# EAGLE design 009 (EAGLE 9.6.2)
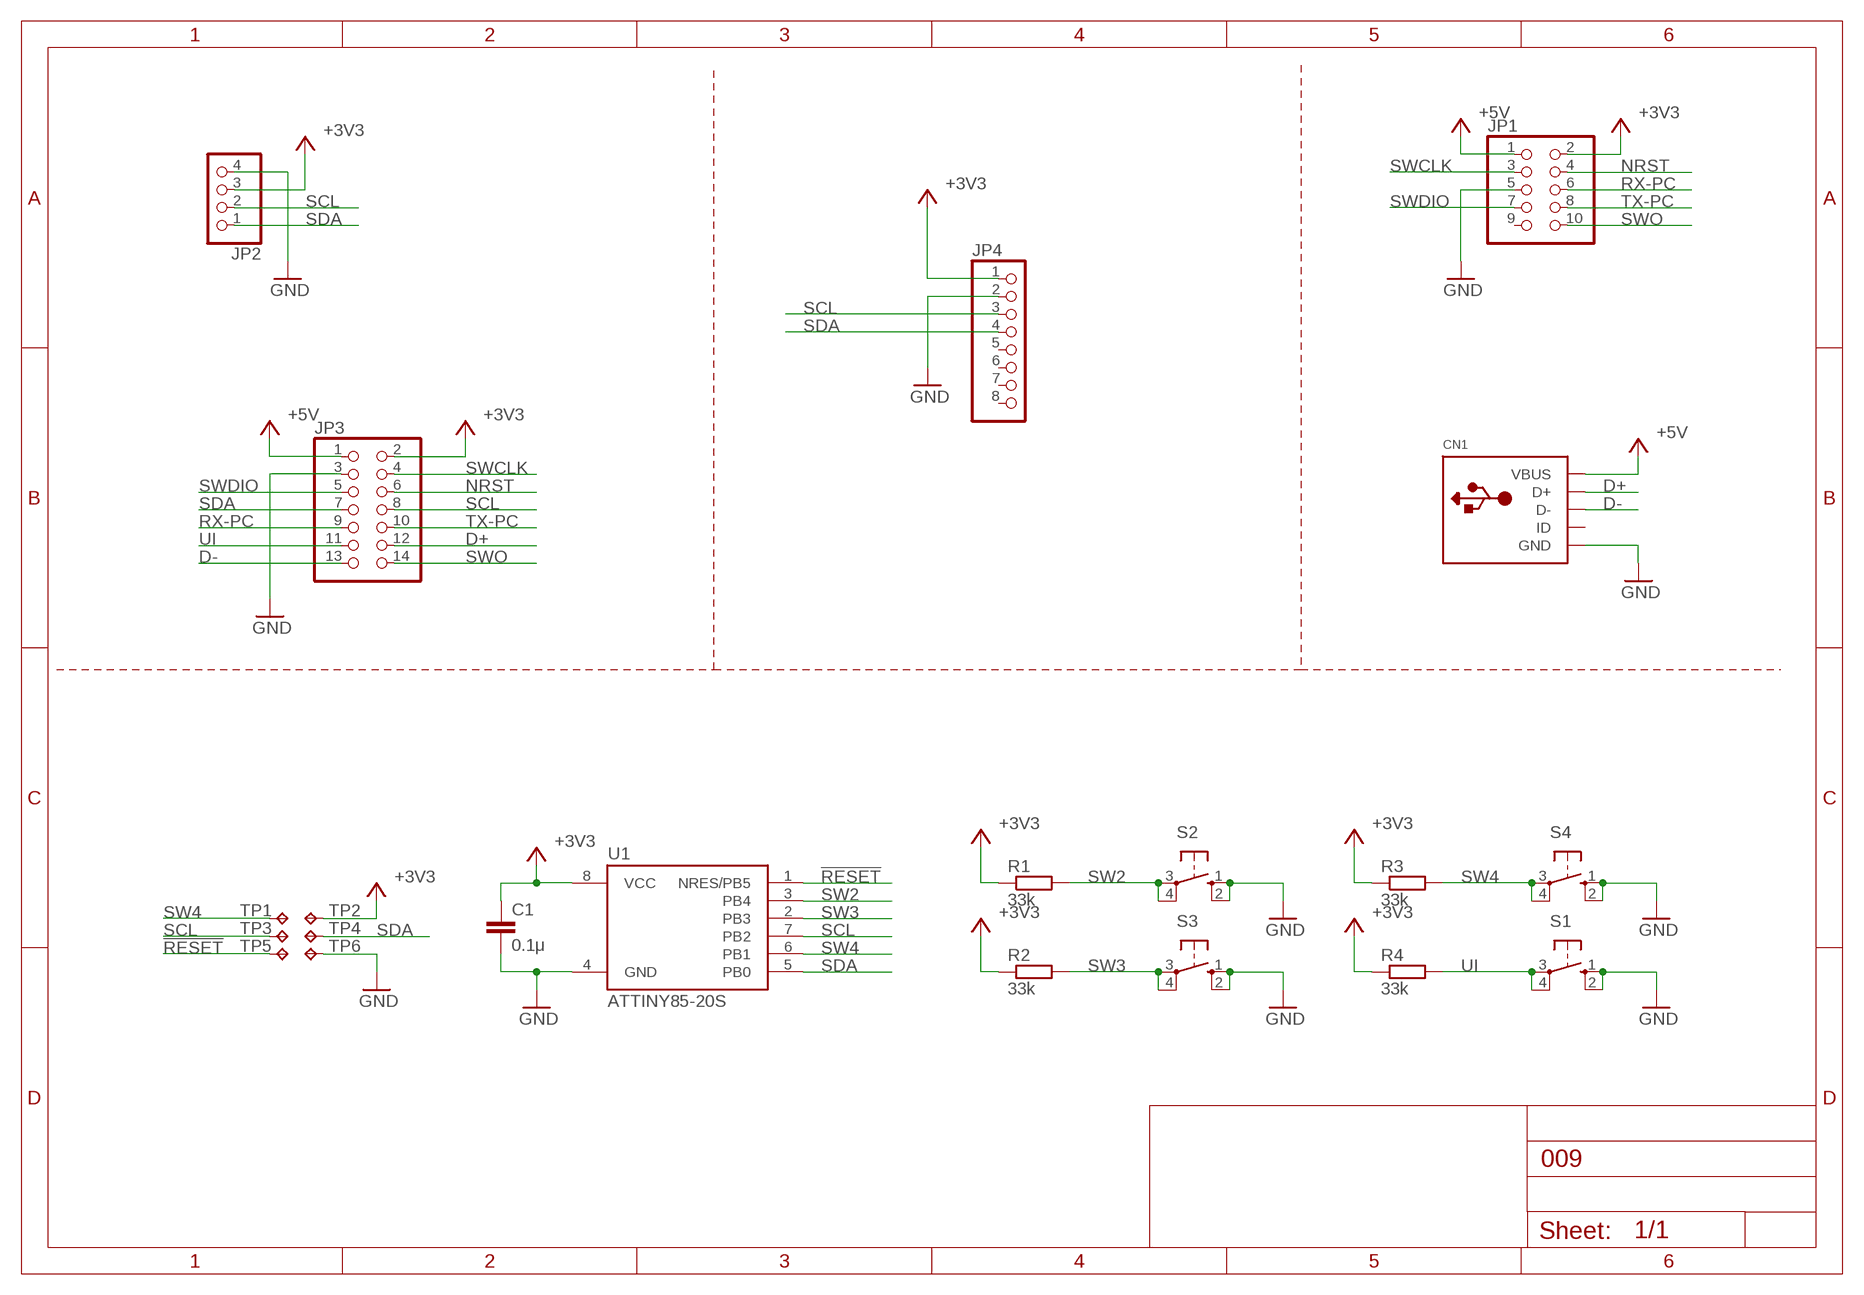
[diagram p0: schematic, sheet 1]

## Parts
C1  0.1μ  C-EUC0603  [C0603]
CN1  USBTHM  [USB-MINIB-THM]
JP1  PINHD-2X5  [2X05]
JP2  PINHD-1X4  [1X04]
JP3  PINHD-2X7/90  [2X07/90]
JP4  PINHD-1X8  [1X08]
R1  33k  R-EU_R0603  [R0603]
R2  33k  R-EU_R0603  [R0603]
R3  33k  R-EU_R0603  [R0603]
R4  33k  R-EU_R0603  [R0603]
S1  40-XX  [B3F-40XX]
S2  40-XX  [B3F-40XX]
S3  10-XX  [B3F-10XX]
S4  10-XX  [B3F-10XX]
TP1  TPTP15SQ  [TP15SQ]
TP2  TPTP15R  [TP15R]
TP3  TPTP15R  [TP15R]
TP4  TPTP15R  [TP15R]
TP5  TPTP15R  [TP15R]
TP6  TPTP15R  [TP15R]
U1  ATTINY85-20S  [SOIC8_EIAJ_208MIL]

## Nets
!RESET: TP5.TP U1.1(NRES/PB5)
+3V3 [PWR]: C1.1 JP1.2 JP2.3 JP3.2 JP4.1 R1.1 R2.1 R3.1 R4.1 TP2.TP U1.8(VCC)
+5V [PWR]: CN1.VBUS JP1.1 JP3.1
D+: CN1.D+ JP3.12
D-: CN1.D- JP3.13
GND [PWR]: C1.2 CN1.GND JP1.5 JP2.4 JP3.3 JP4.2 S1.1(S) S1.2(S1) S2.1(S) S2.2(S1) S3.1(S) S3.2(S1) S4.1(S) S4.2(S1) TP6.TP U1.4(GND)
NRST: JP1.4 JP3.6
RX-PC: JP1.6 JP3.9
SCL: JP2.2 JP3.8 JP4.3 TP3.TP U1.7(PB2)
SDA: JP2.1 JP3.7 JP4.4 TP4.TP U1.5(PB0)
SW2: R1.2 S2.3(P) S2.4(P1) U1.3(PB4)
SW3: R2.2 S3.3(P) S3.4(P1) U1.2(PB3)
SW4: R3.2 S4.3(P) S4.4(P1) TP1.TP U1.6(PB1)
SWCLK: JP1.3 JP3.4
SWDIO: JP1.7 JP3.5
SWO: JP1.10 JP3.14
TX-PC: JP1.8 JP3.10
UI: JP3.11 R4.2 S1.3(P) S1.4(P1)
Unconnected: CN1.ID JP1.9 JP4.5 JP4.6 JP4.7 JP4.8

## Library data of the parts
C1 = rcl:C-EU: CAPACITOR, European symbol; SPICEPREFIX: C
CN1 = adafruit:USB: USB Connectors USBMINIB - Surface Mount Female Mini-B USB Connector 4UConnector: 06564 By microbuilder.eu Thru-hole RA Female Mini-B USB Connector 4UConnector: 18732 By ladyada.net
JP1 = pinhead:PINHD-2X5: PIN HEADER
JP2 = pinhead:PINHD-1X4: PIN HEADER
JP3 = pinhead:PINHD-2X7: PIN HEADER
JP4 = pinhead:PINHD-1X8: PIN HEADER
R1-R4 = rcl:R-EU_: RESISTOR, European symbol; SPICEPREFIX: R
S1 S2 = switch-omron:40-XX: OMRON SWITCH; MF: OMRON COMPONENTS USA; MPN: B3F-4000; OC_FARNELL: 176434; OC_NEWARK: 36K3105
S3 S4 = switch-omron:10-XX: OMRON SWITCH; MPN: B3F-1000; OC_FARNELL: 176432; OC_NEWARK: 36M3542
TP1-TP6 = testpad:TP: Test pad
U1 = _hhn_attiny25_45_85:ATTINY85*: ATMEL ATtiny 85 Packages: P = PDIP 08 30mil S = SOIC 08 EIAJ 208mil Technologies Note: for complete ordering code (temp. range, finish, tape&reel etc.) see www.atmel.com • Supply Voltage: V = (1.8…5.5)V | [blank] = (2.7…5.5)V • Speed: 10 = 10 MHz | 20 = 20 MHz Author: Dipl.-Ing. FH Rainer Bayer HHN Hochschule Heilbronn (Heilbronn University), rainer.bayer@hs-heilbronn.de Ingenieurbüro ing-rb, mail@ing-rb.de

## Net classes
0 default: width 0.508 mm
1 PWR: width 0.762 mm

## Board
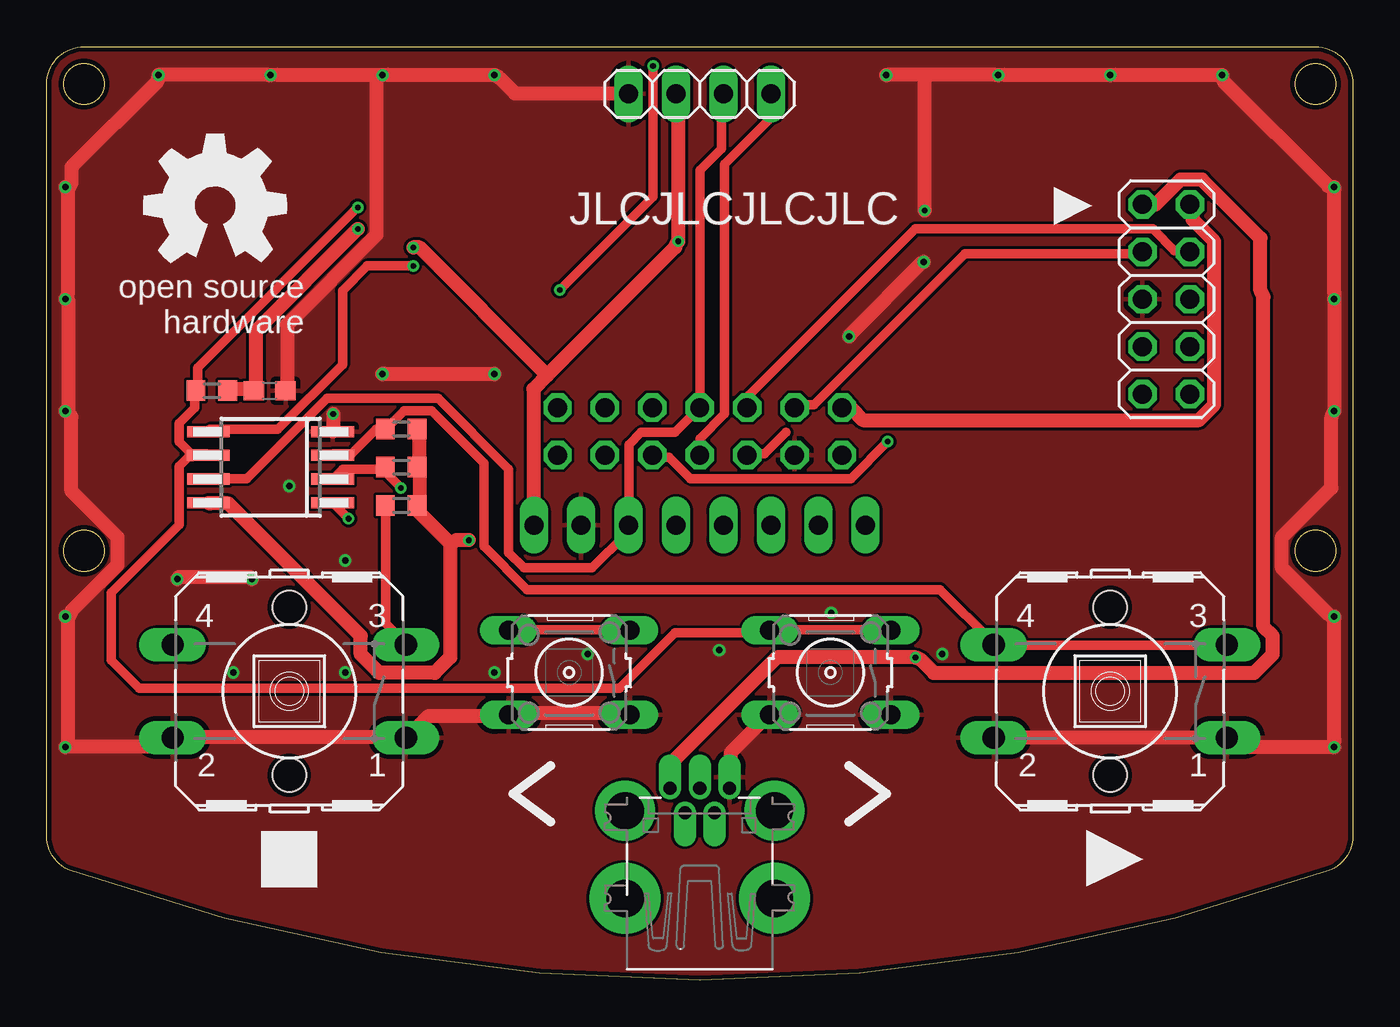
[diagram p1: board, top side]
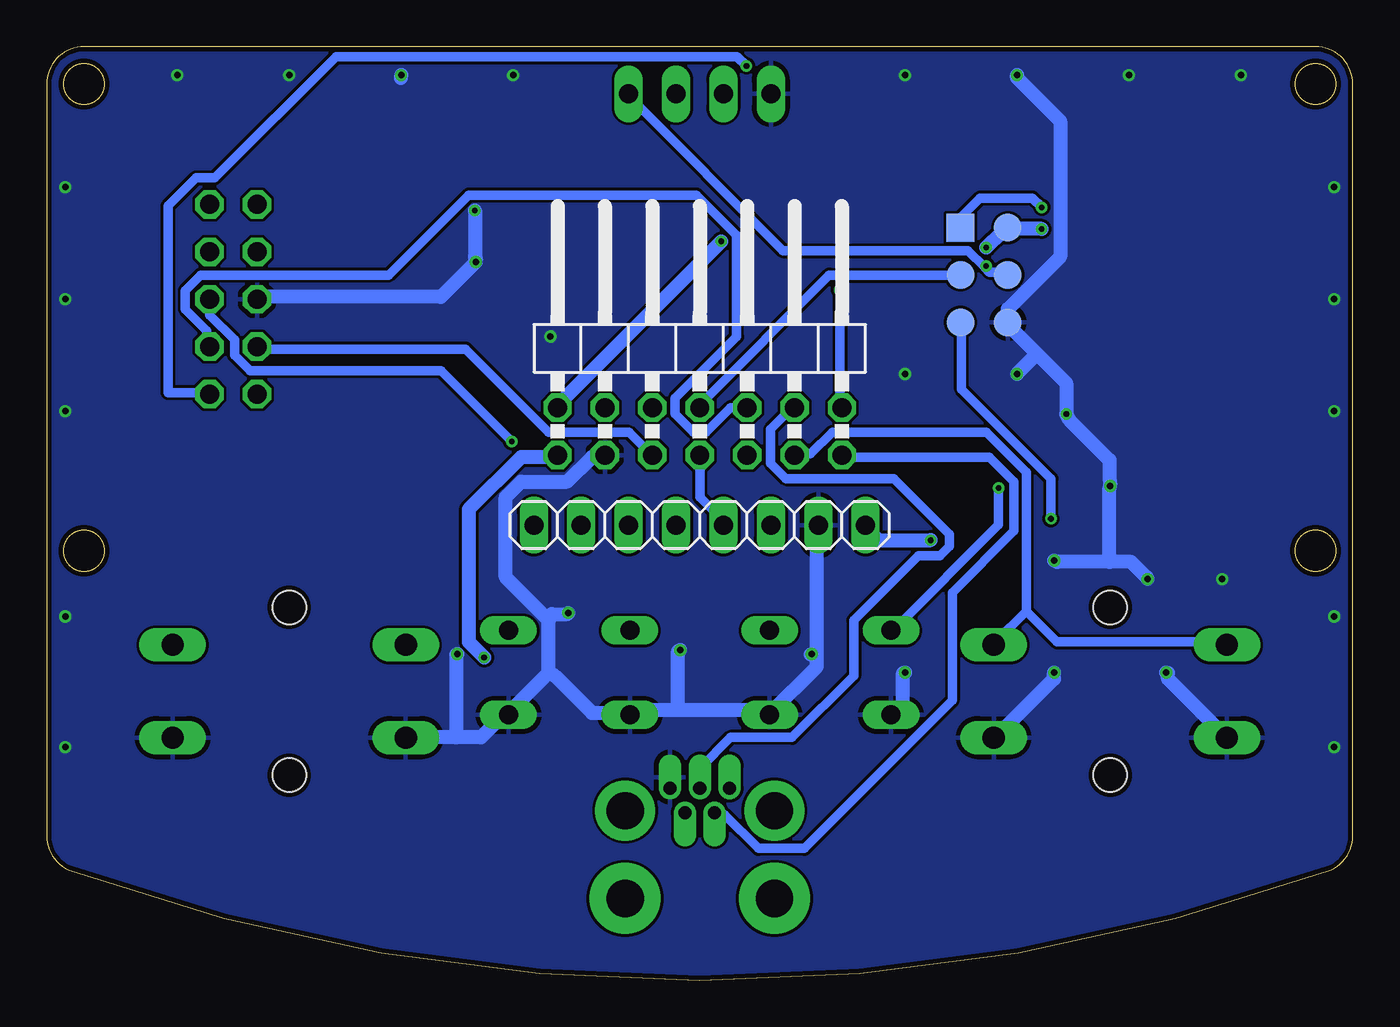
[diagram p2: board, bottom side, seen from below]

Size 70 x 50 mm. Coordinates in mm from the lower left corner, seen from the top.
Outline: 0,48 arc-90 2,50 68,50 arc-90 70,48 70,7.72 arc-70 68.67,5.84 arc-39 1.33,5.84 arc-70 0,7.72 0,48
Outline: circle at 68,23 radius 1.1
Outline: circle at 68,48 radius 1.1
Outline: circle at 2,23 radius 1.1
Outline: circle at 2,48 radius 1.1
Copper layers (1*16): Top 0.035mm / dielectric 1.5mm / Bottom 0.035mm
Design rules "SeeedStudio_2layer_DRU_no_angle_20140221": minimum track width 6mil, minimum drill 12mil, track to track 6mil, track to pad 6mil, pad to pad 6mil, via to via 6mil, smd to smd 0mil, copper to edge 10mil, drill to drill 10mil, minimum pad ring 10mil, minimum via ring 6mil, stop-mask expansion 2mil, vias tented up to drill 100mil, thermal gap 10mil

### Footprints (pad centres in the part's own frame; a part is rotated, then mirrored left to right if it is on the bottom)
C0603 = smd 1.1 x 1: 1 -0.85,0; 2 0.85,0
USB-MINIB-THM = drill 0.7 offset: D+ 0,9.8; D- -0.8,8.5; GND 1.6,9.8; ID 0.8,8.5; VBUS -1.6,9.8 | drill 2 pad 3.81: GND1 -4,3.9; GND4 4,3.9 | drill 2 pad 3.2: GND2 -4,8.6; GND3 4,8.6
2X05 = drill 1.016 octagon: 1 -5.08,-1.27; 2 -5.08,1.27; 3 -2.54,-1.27; 4 -2.54,1.27; 5 0,-1.27; 6 0,1.27; 7 2.54,-1.27; 8 2.54,1.27; 9 5.08,-1.27; 10 5.08,1.27
1X04 = drill 1.016 long: 1 -3.81,0; 2 -1.27,0; 3 1.27,0; 4 3.81,0
2X07/90 = drill 1.016 octagon: 1 -7.62,-6.35; 2 -7.62,-3.81; 3 -5.08,-6.35; 4 -5.08,-3.81; 5 -2.54,-6.35; 6 -2.54,-3.81; 7 0,-6.35; 8 0,-3.81; 9 2.54,-6.35; 10 2.54,-3.81; 11 5.08,-6.35; 12 5.08,-3.81; 13 7.62,-6.35; 14 7.62,-3.81
1X08 = drill 1.016 long: 1 -8.89,0; 2 -6.35,0; 3 -3.81,0; 4 -1.27,0; 5 1.27,0; 6 3.81,0; 7 6.35,0; 8 8.89,0
R0603 = smd 1 x 1.1: 1 -0.85,0; 2 0.85,0
B3F-40XX = drill 1.194 long: 1 -6.248,2.489; 2 6.248,2.489; 3 -6.248,-2.489; 4 6.248,-2.489 | hole 1.803: 0,-4.496; 0,4.496
B3F-10XX = drill 1.016 long: 1 -3.251,2.261; 2 3.251,2.261; 3 -3.251,-2.261; 4 3.251,-2.261
TP15SQ = smd 1.5 x 1.5: TP 0,0
TP15R = smd 1.5 x 1.5: TP 0,0
SOIC8_EIAJ_208MIL = smd 0.6 x 2.286: 1 -1.905,-3.33; 2 -0.635,-3.33; 3 0.635,-3.33; 4 1.905,-3.33; 5 1.905,3.33; 6 0.635,3.33; 7 -0.635,3.33; 8 -1.905,3.33

### Placement (x,y rotation side)
C1  11.95,31.57 0 top
CN1  35,0.47 0 top
JP1  60,36.47 270 top
JP2  35,47.47 180 top
JP3  35,34.47 0 bottom
JP4  35,24.37 180 bottom
R1  19,29.52 180 top
R2  19,27.47 180 top
R3  8.85,31.57 180 top
R4  19,25.42 180 top
S1  13,15.47 180 top
S2  57,15.47 180 top
S3  28,16.47 180 top
S4  42,16.47 180 top
TP1  21.03,40.31 0 bottom
TP2  18.49,40.31 0 bottom
TP3  21.03,37.77 0 bottom
TP4  18.49,37.77 0 bottom
TP5  21.03,35.23 0 bottom
TP6  18.49,35.23 0 bottom
U1  12,27.47 90 top
U$1  [OSHW_8MM]  9,41.47 0 top

### Tracks (layer width: path | path; a pad name or v marks a point on that pad's centre or on a via)
!RESET  (via drill 0.3)
  Top 0.508: v16.18,24.71 15.35,25.54 U1.1
  Bottom 0.508: v16.18,24.71 16.18,26.86 20.97,31.65 20.97,35.12 TP5.TP
+3V3  (via drill 0.3)
  Top 0.762: R1.1 19.98,29.5 19.98,27.85 R2.1 19.98,27.36 19.98,25.54 R4.1 19.98,25.05 21.63,23.39 | 21.63,23.39 21.63,17.29 20.8,16.46 17.83,16.46 16.84,17.45 16.84,18.44 9.74,25.54 8.75,25.54 U1.8 | R3.1 9.74,31.65 11.06,31.65 C1.1 11.23,31.98 11.23,34.79 v16.67,40.23 | JP2.3 33.84,47.33 v33.84,39.57 33.68,39.24 26.83,32.39 | 42.76,30.82 JP3.2 43.09,30.66 43.75,30 61.75,30 62.57,30.82 62.57,39.57 61.42,40.73 61.42,41.39 JP1.2 | 26.09,24.47 26.09,31.65 26.83,32.39 | 26.09,24.47 26.09,24.38 | v19.65,39.24 19.98,39.24 26.83,32.39 | v22.62,23.56 21.96,23.56 21.63,23.39 | JP4.1 26,24.47 26.09,24.47
  Bottom 0.762: v16.67,40.23 18.49,40.23 TP2.TP 18.82,40.07 v19.65,39.24 | v33.84,39.57 42.59,30.82 JP3.2 | v22.62,23.56 25.42,23.56 25.92,24.05 | 26.09,24.22 25.92,24.05 | JP4.1 26,23.97 25.92,24.05
+5V  (via drill 0.3)
  Top 0.762: CN1.VBUS 33.51,10.35 33.51,11.67 39.13,17.29 v46.56,17.29 46.89,17.12 47.55,16.46 64.72,16.46 65.71,17.45 65.71,18.44 65.21,18.94 65.21,36.6 65.05,36.93 65.05,39.74 61.91,42.88 60.76,42.88 59.44,41.56 58.77,41.56 JP1.1
  Bottom 0.762: v46.56,17.29 47.38,18.11 47.38,25.21 44.58,28.02 42.76,28.02 JP3.1
D+
  Bottom 0.508: CN1.D+ 35,11.34 33.35,12.99 30.05,12.99 26.74,16.29 26.74,19.27 23.28,22.73 22.12,22.73 21.63,23.23 21.63,23.89 24.6,26.86 30.38,26.86 31.2,27.69 31.2,29.5 30.05,30.66 JP3.12
D-
  Bottom 0.508: CN1.D- 34.17,8.87 33.68,8.87 31.86,7.05 29.39,7.05 21.46,14.97 21.46,20.75 18.16,24.05 18.16,26.7 19.48,28.02 27.24,28.02 JP3.13
GND  (via drill 0.3, 0.35)
  Top 0.762: 1.15,30.49 1.15,36.44 v1,36.47 1.15,36.77 1.15,42.38 | 1.15,30.49 v1,30.47 | 1.15,42.38 v1,42.47 | 17.66,48.49 12.38,48.49 v12,48.47 11.89,48.49 6.11,48.49 v6,48.47 5.94,48.16 1.32,43.54 1.32,42.71 1.15,42.38 | 17.66,48.49 18,48.49 v18,48.47 18.32,48.49 23.94,48.49 v24,48.47 24.27,48.32 25.09,47.5 31.04,47.5 JP2.4 | 17.66,48.49 17.66,39.9 12.88,35.12 12.88,31.65 C1.2 | v15.35,30.33 15.35,29.5 U1.4 | 1.15,12.5 6.27,12.5 6.6,12.83 S1.2 7.1,12.99 18.98,12.99 S1.1 19.32,12.99 20.47,14.15 24.6,14.15 S3.2 25.09,14.31 31.2,14.31 S3.1 | 1.15,12.5 v1,12.47 | 1.15,12.5 1.15,19.43 | 1.15,19.43 v1,19.47 | 47.05,48.49 50.85,48.49 v51,48.47 51.34,48.49 56.96,48.49 v57,48.47 57.29,48.49 62.9,48.49 v63,48.47 63.07,48.16 68.68,42.55 v69,42.47 69.01,42.38 69.01,36.77 v69,36.47 69.01,36.44 69.01,30.49 v69,30.47 68.85,30.16 68.85,26.37 66.2,23.72 66.2,22.07 68.68,19.6 v69,19.47 69.01,19.43 69.01,12.83 68.85,12.5 | 47.05,48.49 45.07,48.49 v45,48.47 | 68.85,12.5 63.73,12.5 63.4,12.83 S2.1 62.9,12.99 50.85,12.99 S2.2 | 68.85,12.5 v69,12.47 | CN1.GND 36.65,10.35 36.65,12.17 38.63,14.15 S4.2 | 1.15,30.49 1.32,30.16 1.32,26.2 3.8,23.72 3.8,22.24 1.32,19.76 1.15,19.43 | v43,34.47 43.09,34.62 46.89,38.42 v47,38.47 | v7,21.47 7.1,21.58 10.89,21.58 v11,21.47 | v24,32.47 23.94,32.47 18.16,32.47 v18,32.47 | 47.05,48.49 v47.05,41.22
  Bottom 0.762: v18,48.47 18,48.32 15.68,46.01 15.68,38.75 18.49,35.94 TP6.TP 18.32,34.95 16.92,33.55 | 16.92,33.55 15.35,31.98 v15.35,30.33 15.19,30 13.04,27.85 13.04,26.86 v13,26.47 13.04,26.37 13.04,22.4 | 28.73,17.45 28.73,16.79 31.2,14.31 S3.1 31.53,14.48 36.16,14.48 | 28.73,17.45 28.73,24.38 JP4.2 | 51.02,48.32 v51,48.47 | 43.09,19.27 45.4,21.58 45.4,25.87 44.58,26.7 42.1,26.7 40.78,28.02 40.12,28.02 JP3.3 | 43.09,16.46 43.09,19.27 | 43.09,16.46 45.24,14.31 S4.1 45.57,14.15 46.72,12.99 48.04,12.99 | 48.04,12.99 50.68,12.99 S2.2 | 43.09,16.46 42.76,16.29 40.78,14.31 38.8,14.31 S4.2 38.47,14.48 36.16,14.48 | JP1.5 58.61,36.6 48.87,36.6 v47,38.47 47.05,38.75 v47.05,41.22 | 13.04,22.4 11.89,22.4 11.06,21.58 v11,21.47 | 13.04,22.4 15.85,22.4 v16,22.47 | v10,16.47 9.91,16.46 9.91,16.13 6.77,12.99 S1.2 | v16,16.47 16.01,16.46 16.01,16.13 19.15,12.99 S1.1 | v24,16.47 24.1,16.46 24.1,14.81 24.6,14.31 S3.2 | v29,17.47 29.06,17.45 28.73,17.45 | 36.16,14.48 36.16,17.62 v36.05,17.67 | v42.05,19.67 42.1,19.6 42.92,19.6 43.09,19.27 | 16.92,33.55 v18,32.47 | 48.04,12.99 48.04,17.45 v48,17.47
  pour Top: -4,53.47 -4,-3.53 74,-3.53 74,53.47
  pour Bottom: -4,53.47 -4,-3.53 74,-3.53 74,53.47
NRST
  Top 0.508: JP3.6 37.64,30.82 37.64,31.32 46.56,40.23 59.27,40.23 60.42,39.08 61.25,39.08 JP1.4
RX-PC  (via drill 0.3)
  Top 0.508: JP3.9 32.52,28.02 33.35,28.02 34.51,26.86 43.09,26.86 v45.07,28.84
  Bottom 0.508: v45.07,28.84 48.87,32.64 59.11,32.64 59.93,33.47 59.93,34.29 61.25,35.61 61.25,36.44 JP1.6
SCL
  Top 0.508: U1.7 8.75,26.86 10.73,26.86 15.02,31.15 20.97,31.15 24.76,27.36 24.76,22.9 25.59,22.07 29.22,22.07 31.04,23.89 31.04,24.22 31,24.47 | JP2.2 36.16,47.33 36.16,44.53 35,43.37 JP3.8 34.84,30.49 33.68,29.34 31.86,29.34 31.2,28.68 31.2,24.55 31,24.47 | 31,24.47 JP4.3
  Bottom 0.508: TP3.TP 21.13,37.76 28.07,37.76 35,30.82 JP3.8
SDA  (via drill 0.3)
  Top 0.508: v19.65,38.25 17.17,38.25 15.85,36.93 15.85,32.97 12.38,29.5 8.75,29.5 U1.5 | JP3.7 35,29.01 36.32,30.33 36.32,43.7 38.8,46.18 38.8,47.33 JP2.1
  Bottom 0.508: JP3.7 35,25.87 33.84,24.71 33.84,24.47 | 33.84,24.38 33.84,24.47 | 19.73,38.17 20.64,39.08 30.54,39.08 38.8,47.33 JP2.1 | 19.73,38.17 19.48,37.92 18.49,37.92 TP4.TP | v19.65,38.25 19.73,38.17 | JP4.4 34,24.47 33.84,24.47
SW2
  Top 0.508: U1.3 15.35,28.18 16.34,28.18 17.66,29.5 18,29.5 R1.2 18.32,29.67 19.15,30.49 20.64,30.49 23.44,27.69 23.44,23.23 25.75,20.92 47.88,20.92 50.68,18.11 S2.4 51.02,17.95 63.23,17.95 S2.3
SW3  (via drill 0.3)
  Top 0.508: U1.2 15.35,26.86 15.85,27.36 18,27.36 R2.2 18.16,27.19 v18.98,26.37 | S3.3 31.2,18.77 24.76,18.77 S3.4
  Bottom 0.508: v18.98,26.37 18.98,24.38 24.6,18.77 S3.4
SW4  (via drill 0.3)
  Top 0.508: S4.3 45.24,18.77 38.8,18.77 S4.4 38.63,18.61 33.68,18.61 30.71,15.63 4.95,15.63 3.47,17.12 3.47,20.75 7.1,24.38 7.1,27.52 7.59,28.02 U1.6 8.58,28.18 7.76,28.18 7.1,28.84 7.1,29.83 7.92,30.66 7.92,31.48 R3.2 8.09,31.81 8.09,32.8 v16.67,41.39
  Bottom 0.508: v16.67,41.39 17.17,41.89 19.98,41.89 20.97,40.89 20.97,40.4 TP1.TP
SWCLK
  Top 0.508: JP3.4 40.12,30.82 41.11,30.82 49.2,38.91 58.61,38.91 JP1.3
SWDIO
  Top 0.508: 39.62,29.34 38.47,28.18 37.64,28.18 JP3.5
  Bottom 0.508: JP1.7 58.61,33.8 47.55,33.8 43.09,29.34 38.8,29.34 37.64,28.18 JP3.5
SWO  (via drill 0.3)
  Top 0.508: v27.5,36.97 32.5,41.97 v32.5,48.97
  Bottom 0.508: v27.5,36.97 27.5,30.97 JP3.14 | v32.5,48.97 33,49.47 54.5,49.47 61,42.97 62,42.97 63.5,41.47 63.5,31.47 61.5,31.47 JP1.10
TX-PC
  Bottom 0.508: JP3.10 32.52,30.66 33.35,30.66 34.67,29.34 35.33,29.34 36.32,30.33 36.32,31.15 33.02,34.46 33.02,39.9 35.16,42.05 47.38,42.05 51.67,37.76 61.75,37.76 62.57,36.93 62.57,35.94 61.42,34.79 61.42,33.96 JP1.8
UI
  Top 0.508: R4.2 18.16,25.38 18.16,19.1 19.15,18.11 S1.3
  Bottom 0.508: 17.5,19.76 17.5,27.19 19.65,29.34 27.9,29.34 29.06,28.18 29.88,28.18 JP3.11 | 17.5,19.76 19.15,18.11 S1.3 | 17.5,19.76 15.85,18.11 6.77,18.11 S1.4

### Text on the board
tPlace: JLCJLCJLCJLC